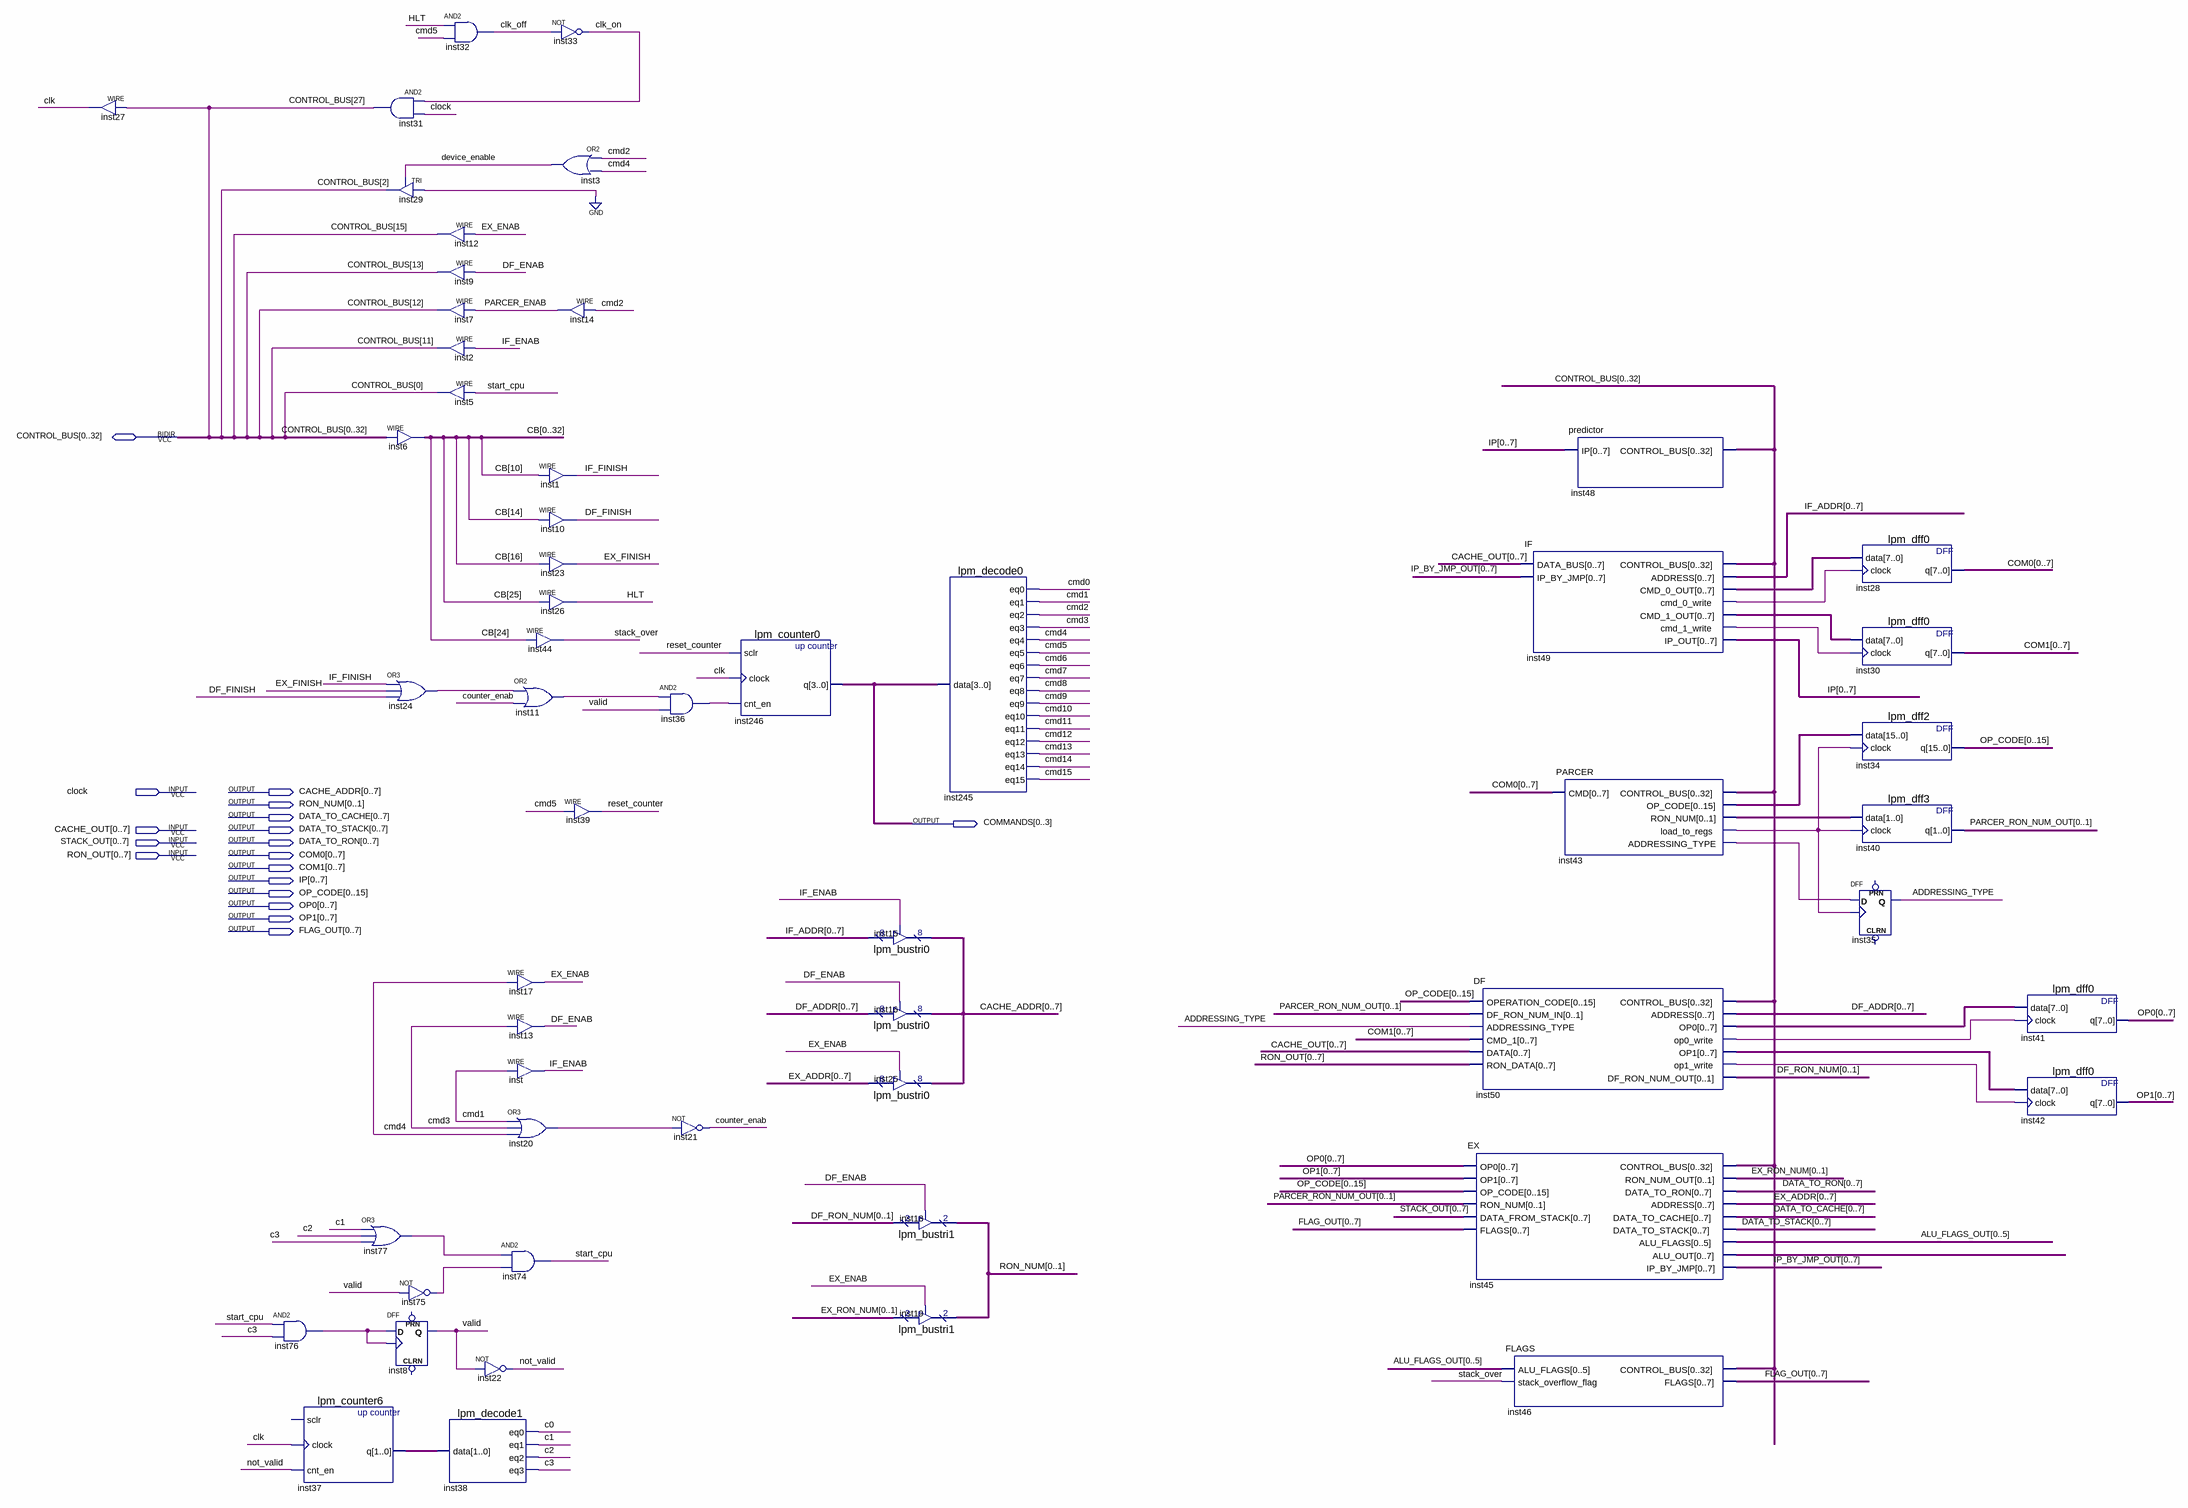
[diagram p0: schematic sheet]
// Quartus schematic CONTROL_UNIT.bdf as structural Verilog: 55 symbols, 18 pins
module CONTROL_UNIT (
  input  clock,
  input  [0:7] CACHE_OUT,
  input  [0:7] STACK_OUT,
  input  [0:7] RON_OUT,
  inout  [0:32] CONTROL_BUS,
  output [0:7] CACHE_ADDR,
  output [0:1] RON_NUM,
  output [0:7] DATA_TO_CACHE,
  output [0:3] COMMANDS,
  output [0:7] DATA_TO_STACK,
  output [0:7] DATA_TO_RON,
  output [0:7] COM0,
  output [0:7] COM1,
  output [0:7] IP,
  output [0:15] OP_CODE,
  output [0:7] OP0,
  output [0:7] OP1,
  output [0:7] FLAG_OUT
);

  wire ADDRESSING_TYPE, c0, c1, c2, c3, clk, clk_off, clk_on, cmd0, cmd1, cmd2, cmd3, cmd4, cmd5, cmd6, cmd7,
       cmd8, cmd9, cmd10, cmd11, cmd12, cmd13, cmd14, cmd15, counter_enab, device_enable, DF_ENAB, DF_FINISH,
       EX_ENAB, EX_FINISH, HLT, IF_ENAB, IF_FINISH, inst11_out, inst20_out, inst24_out, inst36_out,
       inst43_addressing_type, inst43_load_to_regs, inst49_cmd_0_write, inst49_cmd_1_write, inst50_op0_write,
       inst50_op1_write, inst75_out, inst76_out, inst77_out, not_valid, PARCER_ENAB, reset_counter,
       stack_over, start_cpu, valid;
  wire [1:0] DF_RON_NUM, EX_RON_NUM, inst37_q, inst43_ron_num, PARCER_RON_NUM_OUT;
  wire [5:0] ALU_FLAGS_OUT;
  wire [7:0] DF_ADDR, EX_ADDR, IF_ADDR, inst45_alu_out, inst49_cmd_0_out, inst49_cmd_1_out, inst50_op0,
       inst50_op1, IP_BY_JMP_OUT;
  wire [15:0] inst43_op_code;
  wire [32:0] CB;

  assign clk = CONTROL_BUS[27];  // WIRE inst27
  and inst76 (inst76_out, start_cpu, c3);
  lpm_counter6 inst37 (.clock(clk), .cnt_en(not_valid), .q(inst37_q));  // open: sclr
  or inst77 (inst77_out, c1, c2, c3);
  and inst31 (CONTROL_BUS[27], clk_on, clock);
  TRI inst29 (.IN(1'b0), .OE(device_enable), .OUT(CONTROL_BUS[2]));
  assign {CB[0], CB[1], CB[2], CB[3], CB[4], CB[5], CB[6], CB[7], CB[8], CB[9], CB[10], CB[11], CB[12], CB[13], CB[14], CB[15], CB[16], CB[17], CB[18], CB[19], CB[20], CB[21], CB[22], CB[23], CB[24], CB[25], CB[26], CB[27], CB[28], CB[29], CB[30], CB[31], CB[32]} = CONTROL_BUS;  // WIRE inst6
  or inst24 (inst24_out, IF_FINISH, EX_FINISH, DF_FINISH);
  not inst75 (inst75_out, valid);
  DFF inst8 (.CLK(inst76_out), .D(inst76_out), .Q(valid));  // open: CLRN, PRN
  and inst32 (clk_off, HLT, cmd5);
  assign CONTROL_BUS[15] = EX_ENAB;  // WIRE inst12
  assign CONTROL_BUS[13] = DF_ENAB;  // WIRE inst9
  assign CONTROL_BUS[12] = PARCER_ENAB;  // WIRE inst7
  assign CONTROL_BUS[11] = IF_ENAB;  // WIRE inst2
  assign CONTROL_BUS[0] = start_cpu;  // WIRE inst5
  lpm_decode1 inst38 (.data(inst37_q), .eq0(c0), .eq1(c1), .eq2(c2), .eq3(c3));
  or inst11 (inst11_out, inst24_out, counter_enab);
  assign EX_ENAB = cmd4;  // WIRE inst17
  assign DF_ENAB = cmd3;  // WIRE inst13
  assign IF_ENAB = cmd1;  // WIRE inst
  or inst20 (inst20_out, cmd1, cmd3, cmd4);
  and inst74 (start_cpu, inst77_out, inst75_out);
  not inst22 (not_valid, valid);
  not inst33 (clk_on, clk_off);
  or inst3 (device_enable, cmd2, cmd4);
  assign PARCER_ENAB = cmd2;  // WIRE inst14
  assign IF_FINISH = CB[10];  // WIRE inst1
  assign DF_FINISH = CB[14];  // WIRE inst10
  assign EX_FINISH = CB[16];  // WIRE inst23
  assign HLT = CB[25];  // WIRE inst26
  assign stack_over = CB[24];  // WIRE inst44
  assign reset_counter = cmd5;  // WIRE inst39
  and inst36 (inst36_out, inst11_out, valid);
  not inst21 (counter_enab, inst20_out);
  lpm_counter0 inst246 (.sclr(reset_counter), .clock(clk), .cnt_en(inst36_out), .q(COMMANDS));
  lpm_bustri0 inst15 (
    .enabledt(IF_ENAB),
    .data({IF_ADDR[0], IF_ADDR[1], IF_ADDR[2], IF_ADDR[3], IF_ADDR[4], IF_ADDR[5], IF_ADDR[6], IF_ADDR[7]}),
    .tridata(CACHE_ADDR));
  lpm_bustri0 inst16 (
    .enabledt(DF_ENAB),
    .data({DF_ADDR[0], DF_ADDR[1], DF_ADDR[2], DF_ADDR[3], DF_ADDR[4], DF_ADDR[5], DF_ADDR[6], DF_ADDR[7]}),
    .tridata(CACHE_ADDR));
  lpm_bustri0 inst25 (
    .enabledt(EX_ENAB),
    .data({EX_ADDR[0], EX_ADDR[1], EX_ADDR[2], EX_ADDR[3], EX_ADDR[4], EX_ADDR[5], EX_ADDR[6], EX_ADDR[7]}),
    .tridata(CACHE_ADDR));
  lpm_bustri1 inst18 (.enabledt(DF_ENAB), .data({DF_RON_NUM[0], DF_RON_NUM[1]}), .tridata(RON_NUM));
  lpm_bustri1 inst19 (.enabledt(EX_ENAB), .data({EX_RON_NUM[0], EX_RON_NUM[1]}), .tridata(RON_NUM));
  lpm_decode0 inst245 (
    .data(COMMANDS), .eq0(cmd0), .eq1(cmd1), .eq2(cmd2), .eq3(cmd3), .eq4(cmd4), .eq5(cmd5), .eq6(cmd6),
    .eq7(cmd7), .eq8(cmd8), .eq9(cmd9), .eq10(cmd10), .eq11(cmd11), .eq12(cmd12), .eq13(cmd13), .eq14(cmd14),
    .eq15(cmd15));
  DF inst50 (
    .OPERATION_CODE(OP_CODE), .DF_RON_NUM_IN({PARCER_RON_NUM_OUT[0], PARCER_RON_NUM_OUT[1]}),
    .ADDRESSING_TYPE(ADDRESSING_TYPE), .CMD_1(COM1), .DATA(CACHE_OUT), .RON_DATA(RON_OUT),
    .ADDRESS({DF_ADDR[0], DF_ADDR[1], DF_ADDR[2], DF_ADDR[3], DF_ADDR[4], DF_ADDR[5], DF_ADDR[6], DF_ADDR[7]}),
    .OP0(inst50_op0), .op0_write(inst50_op0_write), .OP1(inst50_op1), .op1_write(inst50_op1_write),
    .DF_RON_NUM_OUT({DF_RON_NUM[0], DF_RON_NUM[1]}), .CONTROL_BUS(CONTROL_BUS));
  EX inst45 (
    .OP0(OP0), .OP1(OP1), .OP_CODE(OP_CODE), .RON_NUM({PARCER_RON_NUM_OUT[0], PARCER_RON_NUM_OUT[1]}),
    .DATA_FROM_STACK(STACK_OUT), .FLAGS(FLAG_OUT), .RON_NUM_OUT({EX_RON_NUM[0], EX_RON_NUM[1]}),
    .DATA_TO_RON(DATA_TO_RON),
    .ADDRESS({EX_ADDR[0], EX_ADDR[1], EX_ADDR[2], EX_ADDR[3], EX_ADDR[4], EX_ADDR[5], EX_ADDR[6], EX_ADDR[7]}),
    .DATA_TO_CACHE(DATA_TO_CACHE), .DATA_TO_STACK(DATA_TO_STACK),
    .ALU_FLAGS({ALU_FLAGS_OUT[0], ALU_FLAGS_OUT[1], ALU_FLAGS_OUT[2], ALU_FLAGS_OUT[3], ALU_FLAGS_OUT[4], ALU_FLAGS_OUT[5]}),
    .ALU_OUT(inst45_alu_out),
    .IP_BY_JMP({IP_BY_JMP_OUT[0], IP_BY_JMP_OUT[1], IP_BY_JMP_OUT[2], IP_BY_JMP_OUT[3], IP_BY_JMP_OUT[4], IP_BY_JMP_OUT[5], IP_BY_JMP_OUT[6], IP_BY_JMP_OUT[7]}),
    .CONTROL_BUS(CONTROL_BUS));
  IF inst49 (
    .DATA_BUS(CACHE_OUT),
    .IP_BY_JMP({IP_BY_JMP_OUT[0], IP_BY_JMP_OUT[1], IP_BY_JMP_OUT[2], IP_BY_JMP_OUT[3], IP_BY_JMP_OUT[4], IP_BY_JMP_OUT[5], IP_BY_JMP_OUT[6], IP_BY_JMP_OUT[7]}),
    .ADDRESS({IF_ADDR[0], IF_ADDR[1], IF_ADDR[2], IF_ADDR[3], IF_ADDR[4], IF_ADDR[5], IF_ADDR[6], IF_ADDR[7]}),
    .CMD_0_OUT(inst49_cmd_0_out), .cmd_0_write(inst49_cmd_0_write), .CMD_1_OUT(inst49_cmd_1_out),
    .cmd_1_write(inst49_cmd_1_write), .IP_OUT(IP), .CONTROL_BUS(CONTROL_BUS));
  FLAGS inst46 (
    .ALU_FLAGS({ALU_FLAGS_OUT[0], ALU_FLAGS_OUT[1], ALU_FLAGS_OUT[2], ALU_FLAGS_OUT[3], ALU_FLAGS_OUT[4], ALU_FLAGS_OUT[5]}),
    .stack_overflow_flag(stack_over), .FLAGS(FLAG_OUT), .CONTROL_BUS(CONTROL_BUS));
  predictor inst48 (.IP(IP), .CONTROL_BUS(CONTROL_BUS));
  PARCER inst43 (
    .CMD(COM0), .OP_CODE(inst43_op_code), .RON_NUM(inst43_ron_num), .load_to_regs(inst43_load_to_regs),
    .ADDRESSING_TYPE(inst43_addressing_type), .CONTROL_BUS(CONTROL_BUS));
  lpm_dff0 inst28 (.data(inst49_cmd_0_out), .clock(inst49_cmd_0_write), .q(COM0));
  lpm_dff0 inst30 (.data(inst49_cmd_1_out), .clock(inst49_cmd_1_write), .q(COM1));
  lpm_dff2 inst34 (.data(inst43_op_code), .clock(inst43_load_to_regs), .q(OP_CODE));
  lpm_dff3 inst40 (
    .data(inst43_ron_num), .clock(inst43_load_to_regs), .q({PARCER_RON_NUM_OUT[0], PARCER_RON_NUM_OUT[1]}));
  DFF inst35 (.CLK(inst43_load_to_regs), .D(inst43_addressing_type), .Q(ADDRESSING_TYPE));  // open: CLRN, PRN
  lpm_dff0 inst41 (.data(inst50_op0), .clock(inst50_op0_write), .q(OP0));
  lpm_dff0 inst42 (.data(inst50_op1), .clock(inst50_op1_write), .q(OP1));
endmodule
